# Altium schematic sheet Main.SchDoc
size A; SheetNumber: 1; SheetTotal: 5
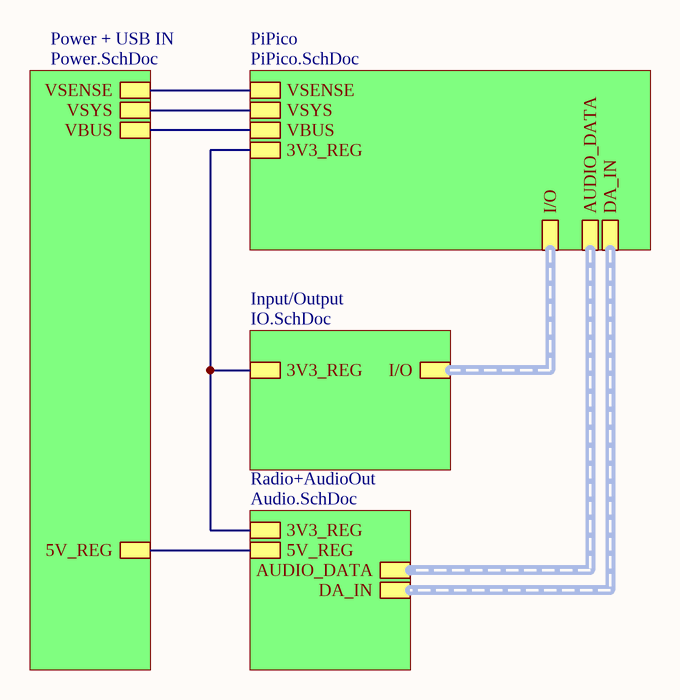
[diagram p0: Main.SchDoc]

## Sub-sheets
Input/Output = IO.SchDoc: 3V3_REG, I/O
PiPico = PiPico.SchDoc: I/O (harness IOSigHarn), VBUS, 3V3_REG, VSENSE, VSYS, AUDIO_DATA (harness AUDIO_DATA), DA_IN (harness DA_IN)
Power + USB IN = Power.SchDoc: VBUS, VSENSE, 5V_REG, VSYS
Radio+AudioOut = Audio.SchDoc: 3V3_REG, 5V_REG, AUDIO_DATA (harness AUDIO_DATA), DA_IN (harness DA_IN)

## Nets
(unnamed): sheet Radio+AudioOut/3V3_REG, sheet Input/Output/3V3_REG, sheet PiPico/3V3_REG
(unnamed): sheet Radio+AudioOut/5V_REG, sheet Power + USB IN/5V_REG
(unnamed): sheet Power + USB IN/VBUS, sheet PiPico/VBUS
(unnamed): sheet Power + USB IN/VSENSE, sheet PiPico/VSENSE
(unnamed): sheet Power + USB IN/VSYS, sheet PiPico/VSYS

## Buses and harness runs
harness sheet Input/Output/I/O = sheet PiPico/I/O
harness sheet PiPico/AUDIO_DATA = sheet Radio+AudioOut/AUDIO_DATA
harness sheet PiPico/DA_IN = sheet Radio+AudioOut/DA_IN